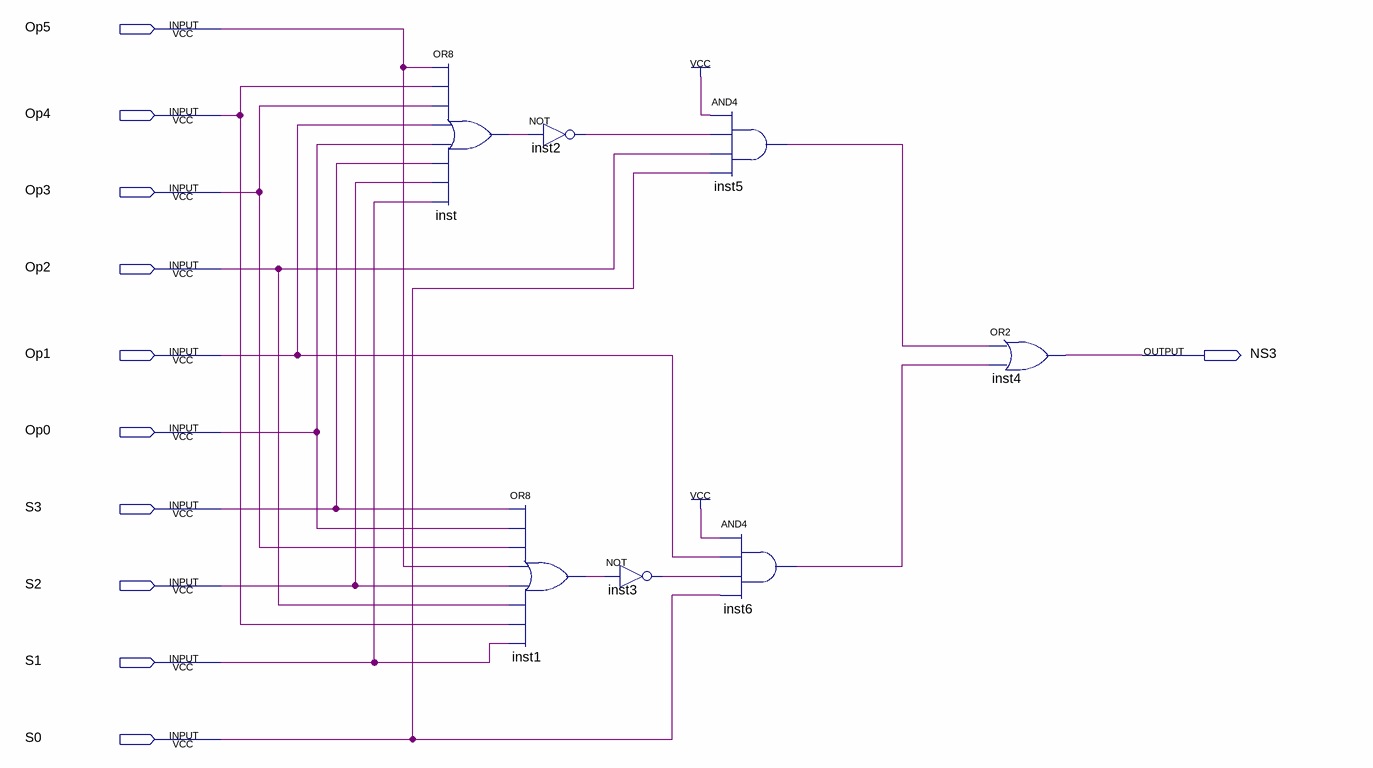
[diagram p0: schematic sheet]
// Quartus schematic NS3.bdf as structural Verilog: 7 symbols, 11 pins
module NS3 (
  input  Op5,
  input  Op4,
  input  Op3,
  input  Op2,
  input  Op1,
  input  Op0,
  input  S3,
  input  S2,
  input  S1,
  input  S0,
  output NS3
);

  wire inst1_out, inst2_out, inst3_out, inst5_out, inst6_out, inst_out;

  or inst (inst_out, Op5, Op4, Op3, Op1, Op0, S3, S2, S1);
  not inst2 (inst2_out, inst_out);
  or inst1 (inst1_out, S3, Op0, Op3, Op5, S2, Op2, Op4, S1);
  not inst3 (inst3_out, inst1_out);
  and inst5 (inst5_out, 1'b1, inst2_out, Op2, S0);
  and inst6 (inst6_out, 1'b1, Op1, inst3_out, S0);
  or inst4 (NS3, inst5_out, inst6_out);
endmodule
